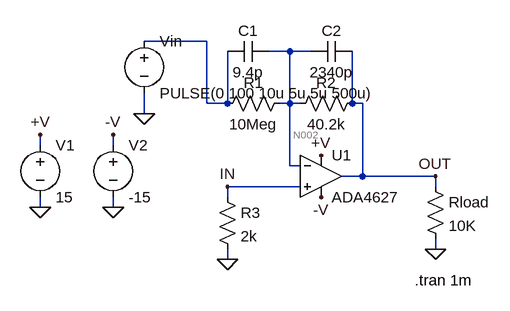
[diagram p0: schematic del250.asc]
* del250.asc
V1 +V 0 15
Vin N001 0 PULSE(0 100 10u 5u 5u 500u)
R1 N002 N001 10Meg
R2 OUT N002 40.2k
V2 -V 0 -15
Rload OUT 0 10K
* U1: ADA4627 (symbol ADA4627 not available, pins judged from their places): In+=IN In-=N002 V+=+V V-=-V OUT=OUT
C1 N002 N001 9.4p
C2 OUT N002 2340p
R3 IN 0 2k
.tran 1m
.backanno
.end

* Results of the author's LTspice run, read from the files saved beside the schematic
* Operating Point, zero values left out:
*   V(+v) = 15 V
*   V(n002) = -292.3 µV
*   V(out) = -294.1 µV
*   V(-v) = -15 V
*   V(in) = 30.05 nV
*   I(R1) = -29.23 pA
*   I(R2) = -44.75 pA
*   I(Rload) = -29.41 nA
*   I(R3) = 15.02 pA
*   I(V1) = -6.899 mA
*   I(Vin) = -29.23 pA
*   I(V2) = 6.899 mA
*   Ix(u1:1) = -15.02 pA
*   Ix(u1:2) = -15.52 pA
*   Ix(u1:99) = 6.899 mA
*   Ix(u1:50) = -6.899 mA
*   Ix(u1:30) = 29.45 nA
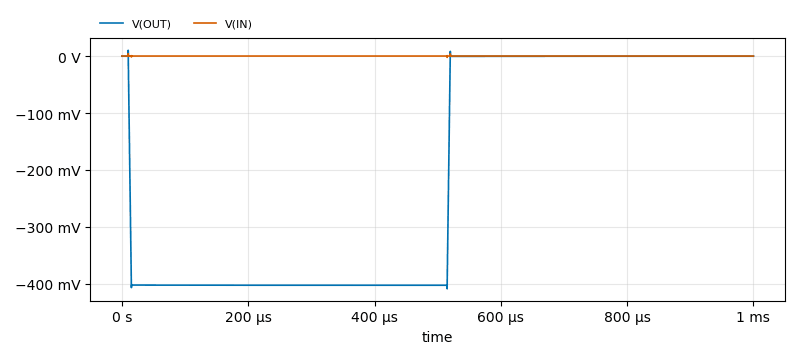
[diagram p1: Transient Analysis of del250.asc, plotted from the saved traces]
* Transient Analysis, 1 run:
*   V(OUT): min -408.5 mV, max 9.957 mV, average -203.3 mV, rms 285.8 mV, last -295.8 µV
*   V(IN): min -2.275 mV, max 4.255 mV, average 76.2 nV, rms 16.24 µV, last 30 nV